# Altium schematic sheet Buzzer.SchDoc: Piezzo Buzzer & Audio Amplifier
size 292 x 193 mm; DocumentNumber: 48; SheetNumber: 36; SheetTotal: 42
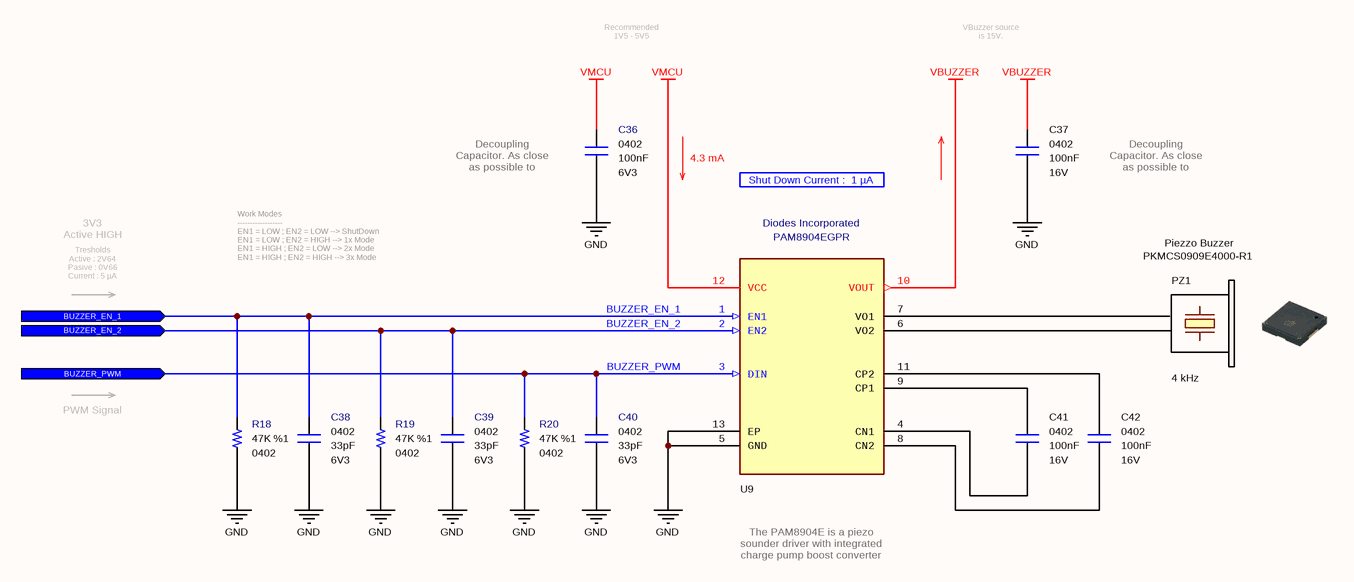
[diagram p0: Buzzer.SchDoc]

## Parts
C36  value 100nF  Case: 0402  Voltage: 6V3  [CAPACITOR_0402]  (hidden comment: Multilayer Ceramic Capacitor)
C37  value 100nF  Case: 0402  Voltage: 16V  [CAPACITOR_0402]  (hidden comment: Multilayer Ceramic Capacitor)
C38  value 33pF  Case: 0402  Voltage: 6V3  [CAPACITOR_0402]  (hidden comment: Multilayer Ceramic Capacitor)
C39  value 33pF  Case: 0402  Voltage: 6V3  [CAPACITOR_0402]  (hidden comment: Multilayer Ceramic Capacitor)
C40  value 33pF  Case: 0402  Voltage: 6V3  [CAPACITOR_0402]  (hidden comment: Multilayer Ceramic Capacitor)
C41  value 100nF  Case: 0402  Voltage: 16V  [CAPACITOR_0402]  (hidden comment: Multilayer Ceramic Capacitor)
C42  value 100nF  Case: 0402  Voltage: 16V  [CAPACITOR_0402]  (hidden comment: Multilayer Ceramic Capacitor)
PZ1  Frequency: 4 kHz  Manufacturer Part Number: PKMCS0909E4000-R1  Device Type: Piezzo Buzzer  [Murata Piezzo Buzzer]  (hidden comment: Piezo Buzzers & Audio Indicators)
R18  value 47K  Tolerance: %1  Case: 0402  [RESISTOR_0402]  (hidden comment: 47K - 0402 - %1 - 1/16W)
R19  value 47K  Tolerance: %1  Case: 0402  [RESISTOR_0402]  (hidden comment: 47K - 0402 - %1 - 1/16W)
R20  value 47K  Tolerance: %1  Case: 0402  [RESISTOR_0402]  (hidden comment: 47K - 0402 - %1 - 1/16W)
U9  Manufacturer Name: Diodes Incorporated  Manufacturer Part Number: PAM8904EGPR  [QFN2020-12]  (hidden comment: Audio Amplifiers)

## Ports
BUZZER_EN_1 (in), BUZZER_EN_2 (in), BUZZER_PWM (in)

## Nets
GND: C36.1 C37.1 C38.1 C39.1 C40.1 R18.1 R19.1 R20.1 U9.5(GND) U9.13(EP)
VBUZZER: C37.2 U9.10(VOUT)
VMCU: C36.2 U9.12(VCC)
BUZZER_EN_1: C38.2 R18.2 U9.1(EN1) ; port BUZZER_EN_1
BUZZER_EN_2: C39.2 R19.2 U9.2(EN2) ; port BUZZER_EN_2
BUZZER_PWM: C40.2 R20.2 U9.3(DIN) ; port BUZZER_PWM
NetC41_1: C41.1 U9.4(CN1)
NetC41_2: C41.2 U9.9(CP1)
NetC42_1: C42.1 U9.8(CN2)
NetC42_2: C42.2 U9.11(CP2)
NetPZ1_1: PZ1.1(+) U9.7(VO1)
NetPZ1_2: PZ1.2(-) U9.6(VO2)

## Notes on the sheet
- Recommended 1V5 - 5V5
- VBuzzer source is 15V.
- (near C36) Decoupling Capacitor. As close as possible to PAM8904 pin-12.
- 4.3 mA
- Shut Down Current :  1 µA
- Decoupling Capacitor. As close as possible to PAM8904 pin-10.
- 3V3
  Active HIGH
- Tresholds
  Active : 2V64
  Pasive : 0V66
  Current : 5 µA
- Work Modes
  ------------------
  EN1 = LOW ; EN2 = LOW --> ShutDown
  EN1 = LOW ; EN2 = HIGH --> 1x Mode
  EN1 = HIGH ; EN2 = LOW --> 2x Mode
  EN1 = HIGH ; EN2 = HIGH --> 3x Mode
- PWM Signal
- The PAM8904E is a piezo sounder driver with integrated charge pump boost converter
- © 2021 All rights reserved.
  This document may not, in whole or in part, be copied, photocopied, reproduced, translated or converted to any electronic or machine readable from without prior written permission of Mehmet Günce Akkoyun.
  Engineer contact : akkoyun@me.com
- Property of
- Engineer :
- Date :
- Size :
- A4
- Time :
- Project :
- Page :
- /
- Customer :
- Product ID :
- Module ID :
- Version :
- File :
- Revision :

## Library data of the parts
C36 = Capacitor - 100nF [0402-6V3]: Capacitor - 100nF [0402-6V3] (Ceramic); Manufacturer Name: AVX; Manufacturer Part Number: 04026D104KAT4A; Dielectric: X5R; Tolerance: %10; Height: 0.25mm; ComponentLink1Description: Mouser; ComponentLink1URL: https://www.mouser.com.tr/ProductDetail/AVX/04026D104KAT4A?qs=sGAEpiMZZMs0AnBnWHyRQPg4iYkCw7IMED%2F4kpqgf7w%3D; ComponentLink2Description: DataSheet; ComponentLink2URL: https://www.mouser.com.tr/datasheet/2/40/cx5r-776519.pdf; ROHS: Yes; Maximum Operating Temperature: +85; Minimum Operating Temperature: -55; Supplier 1: Avnet; Supplier Part Number 1: 04026D104KAT4A; Mouser Part Number: 581-04026D104KAT4A
C37 C41 C42 = Capacitor - 100nF [0402-16V]: Capacitor - 100nF [0402] (Ceramic); Manufacturer Name: AVX; Manufacturer Part Number: 0402YC104KAT2A; Dielectric: X7R; Tolerance: %10; Height: 0.25mm; Mouser Part Number: 581-0402YC104KAT2A; ComponentLink1Description: Mouser; ComponentLink1URL: https://www.mouser.com.tr/ProductDetail/AVX/0402YC104KAT2A?qs=sGAEpiMZZMs0AnBnWHyRQKtaB%2FEehnE2c%2FfISS4arlI%3D; ComponentLink2Description: DataSheet; ComponentLink2URL: https://www.mouser.com.tr/datasheet/2/40/X7RDielectric-777024.pdf; ROHS: Yes; Maximum Operating Temperature: +125; Minimum Operating Temperature: -55; Supplier 1: Mouser; Supplier 2: Digi-Key; Supplier Part Number 1: 581-0402YC104KAT2A; Supplier Part Number 2: 478-7888-1-ND
C38-C40 = Capacitor - 33pF [0402-6V3]: Capacitor - 33pF [0402] (Ceramic); Manufacturer Name: Kemet; Manufacturer Part Number: C0402C330J9RACAUTO; Dielectric: X7R; Tolerance: 10%; Height: 0.5mm; Maximum Operating Temperature: +125; Minimum Operating Temperature: -55; ROHS: Yes; ComponentLink1Description: DataSheet; ComponentLink1URL: https://api.kemet.com/component-edge/download/datasheet/C0402C330J9RACAUTO.pdf; ComponentLink2Description: Mouser; ComponentLink2URL: https://www.mouser.com/Search/Refine.aspx?Keyword=80-C0402C330J9RAUTO; Supplier 1: Mouser; Supplier Part Number 1: 80-C0402C330J9RAUTO; Mouser Part Number: 80-C0402C330J9RAUTO
PZ1 = Buzzer - PKMCS0909E4000-R1: Piezo Buzzers & Audio Indicators Piezo Buzzer 9x9mm 4KHz 1.9mm Thickness; Manufacturer Name: Murata; Sound Level: 65 dBA; Height: 1.9 mm; ROHS: Yes; ComponentLink1Description: DataSheet; ComponentLink1URL: https://www.mouser.com.tr/datasheet/2/281/PKMCS0909E4000-R1-1186610.pdf; ComponentLink2Description: Mouser; ComponentLink2URL: https://www.mouser.com.tr/ProductDetail/Murata-Electronics/PKMCS0909E4000-R1/?qs=%2Fha2pyFadui1K1i3N8Z4%252B4bkKwHbQN%252BSPuj64PQSz0jmNOq7MpVIpg%3D%3D; Supplier 1: RSComponents; Supplier 2: RSComponents; Supplier 3: Mouser; Supplier 4: Arrow Electronics; Supplier 5: Farnell; Supplier 6: Newark; Supplier 7: Digi-Key; Supplier 8: Digi-Key; Supplier 9: Digi-Key; Supplier Part Number 1: 9010898P; Supplier Part Number 2: 9010898; Supplier Part Number 3: 81-PKMCS0909E4000-R1; Supplier Part Number 4: PKMCS0909E4000-R1; Supplier Part Number 5: 2529461; Supplier Part Number 6: 81Y9719; Supplier Part Number 7: 490-9647-1-ND; Supplier Part Number 8: 490-9647-6-ND; Supplier Part Number 9: 490-9647-2-ND; Case: SMD
R18-R20 = Resistor - 47K: Thick Film Resistors - SMD 1/16 W 47 Kohms 1%; Manufacturer Name: Vishay; Manufacturer Part Number: CRCW040247K0FKED; Height: 0.4mm; ComponentLink1Description: DataSheet; ComponentLink1URL: https://www.mouser.com.tr/datasheet/2/427/dcrcwe3-1762152.pdf; ComponentLink2Description: Mouser; ComponentLink2URL: https://www.mouser.com.tr/ProductDetail/Vishay-Dale/CRCW040247K0FKED?qs=sGAEpiMZZMu61qfTUdNhG2DpbjADlD3GL%252B3h1elTxqU%3D; Supplier 1: RSComponents; Supplier 2: Newark; Supplier Part Number 1: 6789361P; Supplier Part Number 2: 52K7097; Supplier 3: Avnet; Supplier 4: RSComponents; Supplier 5: Future Electronics; Supplier 6: Future Electronics; Supplier 7: Newark; Supplier 8: Arrow Electronics; Supplier 9: Mouser; Supplier 10: Newark; Supplier 11: Avnet; Supplier 12: Digi-Key; Supplier 13: Digi-Key; Supplier 14: Digi-Key; Supplier 15: Newark; Supplier 16: Farnell; Supplier 17: Farnell; Supplier 18: Farnell; Supplier 19: Allied Electronics; Supplier 20: Allied Electronics; Supplier 21: Avnet; Supplier 22: Future Electronics; Supplier 23: Future Electronics; Supplier 24: Future Electronics; Supplier 25: Newark; Supplier 26: RSComponents; Supplier 27: RSComponents; Supplier Part Number 3: 52K7097; Supplier Part Number 4: 6789361; Supplier Part Number 5: 2103738; Supplier Part Number 6: 7521222; Supplier Part Number 7: 42K3500; Supplier Part Number 8: CRCW040247K0FKED; Supplier Part Number 12: 541-47.0KLCT-ND; Supplier Part Number 14: 541-47.0KLTR-ND; Supplier Part Number 10: 61M5310; Supplier Part Number 9: 71-CRCW0402-47K-E3; Supplier Part Number 13: 541-47.0KLDKR-ND; Supplier Part Number 11: CRCW040247K0FKED; Supplier Part Number 15: 25AC7165; Supplier Part Number 16: 1469719; Supplier Part Number 18: 2121814; Supplier Part Number 17: 1469719RL; Supplier Part Number 19: 70202660; Supplier Part Number 20: 70272767; Supplier Part Number 21: 42K3500; Supplier Part Number 22: 6128776; Supplier Part Number 24: CRCW040247K0FKED-REEL; Supplier Part Number 23: CRCW040247K0FKED-CUTT; Supplier Part Number 25: 24W2315; Supplier Part Number 26: 1688455; Supplier Part Number 27: 1823505
U9 = IC - PAM8904EGPR: Audio Amplifiers Audio High Volt; Operating Supply Voltage: 1V5-5V5; ComponentLink1Description: DataSheet; ComponentLink1URL: https://www.diodes.com/assets/Datasheets/PAM8904E.pdf; ComponentLink2Description: Mouser; ComponentLink2URL: https://www.mouser.com.tr/ProductDetail/Diodes-Incorporated/PAM8904EGPR/?qs=EBDBlbfErPxEsxcCuoWH6w%3D%3D; Case: VQFN2020-12; Maximum Operating Temperature: +85; Minimum Operating Temperature: -40; Supplier 1: Digi-Key; Supplier 2: Digi-Key; Supplier 3: Digi-Key; Supplier 4: RSComponents; Supplier 5: Mouser; Supplier Part Number 1: 31-PAM8904EGPRCT-ND; Supplier Part Number 2: 31-PAM8904EGPRDKR-ND; Supplier Part Number 3: 31-PAM8904EGPRTR-ND; Supplier Part Number 4: 2060051; Supplier Part Number 5: 621-PAM8904EGPR